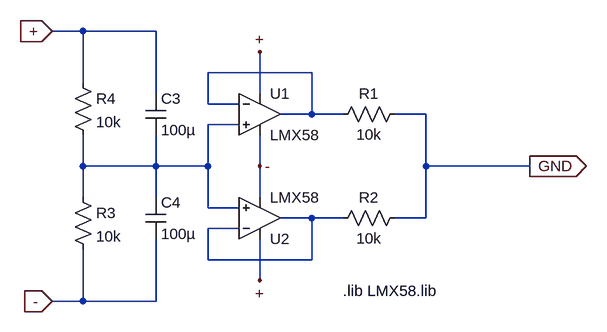
[diagram p0: schematic PSU.asc]
PSU.asc, the LTspice schematic file:
Version 4
SHEET 1 880 680
WIRE -32 -48 -80 -48
WIRE 80 -48 -32 -48
WIRE 320 16 160 16
WIRE -32 32 -32 -48
WIRE 80 48 80 -48
WIRE 240 48 240 -16
WIRE 160 64 160 16
WIRE 208 64 160 64
WIRE 320 80 320 16
WIRE 320 80 272 80
WIRE 368 80 320 80
WIRE 496 80 448 80
WIRE 208 96 160 96
WIRE -32 160 -32 112
WIRE 80 160 80 112
WIRE 80 160 -32 160
WIRE 160 160 160 96
WIRE 160 160 80 160
WIRE 240 160 240 112
WIRE 496 160 496 80
WIRE 656 160 496 160
WIRE -32 208 -32 160
WIRE 80 208 80 160
WIRE 240 208 240 160
WIRE 160 224 160 160
WIRE 208 224 160 224
WIRE 320 240 272 240
WIRE 368 240 320 240
WIRE 496 240 496 160
WIRE 496 240 448 240
WIRE 208 256 160 256
WIRE 160 304 160 256
WIRE 320 304 320 240
WIRE 320 304 160 304
WIRE 240 336 240 272
WIRE -32 368 -32 288
WIRE -32 368 -80 368
WIRE 80 368 80 272
WIRE 80 368 -32 368
FLAG 656 160 GND
IOPIN 656 160 Out
FLAG 240 -16 +
FLAG 240 336 +
FLAG 240 160 -
FLAG -80 -48 +
IOPIN -80 -48 In
FLAG -80 368 -
IOPIN -80 368 In
SYMBOL res 464 64 R90
WINDOW 0 0 56 VBottom 2
WINDOW 3 32 56 VTop 2
SYMATTR InstName R1
SYMATTR Value 10k
SYMBOL res 464 224 R90
WINDOW 0 0 56 VBottom 2
WINDOW 3 32 56 VTop 2
SYMATTR InstName R2
SYMATTR Value 10k
SYMBOL cap 64 48 R0
SYMATTR InstName C3
SYMATTR Value 100µ
SYMBOL cap 64 208 R0
SYMATTR InstName C4
SYMATTR Value 100µ
SYMBOL res -48 192 R0
SYMATTR InstName R3
SYMATTR Value 10k
SYMBOL res -48 16 R0
SYMATTR InstName R4
SYMATTR Value 10k
SYMBOL OpAmps\\opamp2 240 16 R0
SYMATTR InstName U1
SYMATTR Value LMX58
SYMBOL OpAmps\\opamp2 240 304 M180
SYMATTR InstName U2
SYMATTR Value LMX58
TEXT 368 352 Left 2 !.lib LMX58.lib

The netlist it stands for:
* PSU.asc
R1 GND N001 10k
R2 GND N003 10k
C3 + N002 100µ
C4 N002 - 100µ
R3 N002 - 10k
R4 + N002 10k
XU1 N002 N001 + - N001 LMX58  ; pins In+ In- V+ V- OUT
XU2 N002 N003 + - N003 LMX58  ; pins In+ In- V+ V- OUT
.lib LMX58.lib
.backanno
.end